# Altium schematic sheet Charger.SchDoc
size A
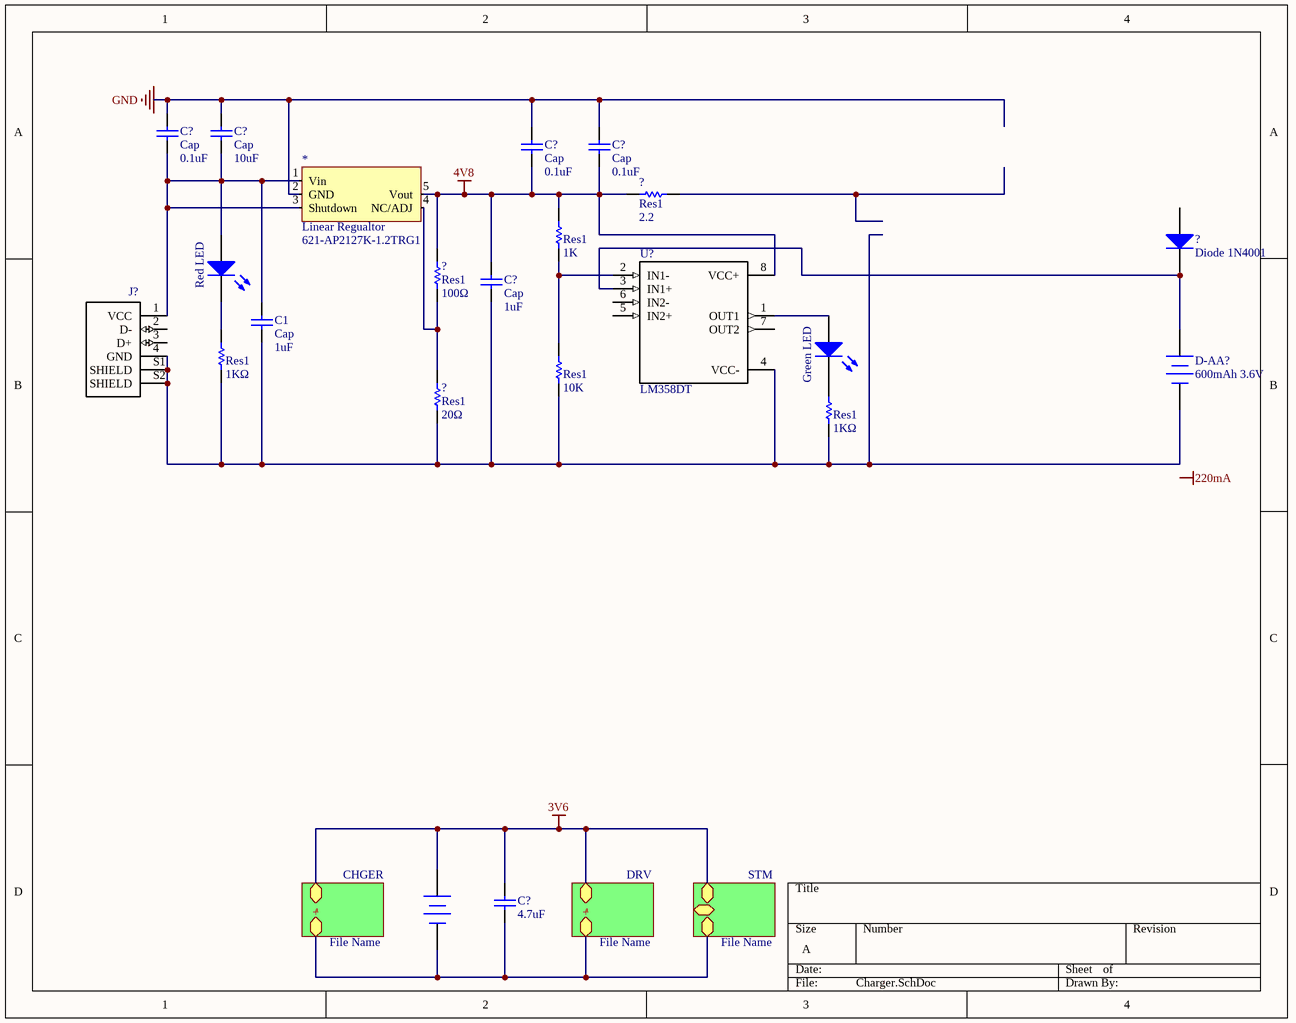
[diagram p0: Charger.SchDoc]

## Parts
(Parts that share a designator on the sheet are numbered #1, #2 ... from top to bottom, then left to right.)
*  Linear Regualtor  Supplier Part Number 1: 621-AP2127K-1.2TRG1  [SOT23-5]
?#1  Res1  value 2.2  [AXIAL-0.3]
?#2  Diode 1N4001  [DO-41]
?#3  Res1  value 1K  [AXIAL-0.3]
?#4  Res1  value 100Ω  [AXIAL-0.3]
?#5  Res1  value 1KΩ  [AXIAL-0.3]
?#6  Res1  value 10K  [AXIAL-0.3]
?#7  Res1  value 20Ω  [AXIAL-0.3]
?#8  Res1  value 1KΩ  [AXIAL-0.3]
C1  Cap  value 1uF  [RAD-0.3]
C?#1  Cap  value 0.1uF  [RAD-0.3]
C?#2  Cap  value 10uF  [RAD-0.3]
C?#3  Cap  value 0.1uF  [RAD-0.3]
C?#4  Cap  value 0.1uF  [RAD-0.3]
C?#5  Cap  value 1uF  [RAD-0.3]
C?#6  value 4.7uF  [RAD-0.3]  (hidden comment: Cap)
D-AA?  600mAh 3.6V
Green_LED  (no value)  [3.2X1.6X1.1]
J?  1-1734028-1  [*TE_1-1734028-1_1-1734028-1(Primary)]  (value not drawn)
N-?  700mAh 2.4V  [BAT-2]  (value not drawn)
Red_LED  (no value)  [LED-1]
U?  LM358DT  [*SOIC127P600X175-8N]

## Sub-sheets
CHGER = File Name: +, -
DRV = File Name: +, -
STM = File Name: +, -,  (bidir)

## Nets
3V6: C?#6.1 N-?.1(+) ; sheet STM/+, sheet DRV/+, sheet CHGER/+
4V8: *.5(Vout) ?#1.2 ?#3.2 ?#4.2 C?#3.1 C?#4.1 C?#5.2 U?.8(VCC+)
GND: *.2(GND) C?#1.2 C?#2.2 C?#3.2 C?#4.2
Net*_1: *.1(Vin) *.3(Shutdown) C1.2 C?#1.1 C?#2.1 J?.1(VCC) Red_LED.1(A)
Net*_4: *.4(NC/ADJ) ?#4.1 ?#7.2
Net?#2_2: ?#2.2(K) D-AA?.1(+) U?.3(IN1+)
Net?#3_1: ?#3.1 ?#6.2 U?.2(IN1-)
Net?#5_1: ?#5.1 ?#6.1 ?#7.1 ?#8.1 C1.1 C?#5.1 D-AA?.2(-) J?.4(GND) J?.S1(SHIELD) J?.S2(SHIELD) U?.4(VCC-)
Net?#5_2: ?#5.2 Red_LED.2(K)
Net?#8_2: ?#8.2 Green_LED.2(K)
NetC?#6_2: C?#6.2 N-?.2(-) ; sheet STM/-, sheet DRV/-, sheet CHGER/-
NetGreen_LED_1: Green_LED.1(A) U?.1(OUT1)

Not connected (* = marked no-connect by the designer): ?#1 1; ?#2 1(A); J? 2(D-) 3(D+); U? 5(IN2+) 6(IN2-) 7(OUT2)

## Notes on the sheet
- Labels drawn without touching a wire or pin: 220mA

## Library data of the parts
?#1 ?#3-?#8 = Res1: Resistor; Published: 8-Jun-2000; LatestRevisionDate: 17-Jul-2002; LatestRevisionNote: Re-released for DXP Platform.; PackageReference: AXIAL-0.3; Publisher: Altium Limited; PackageDescription: Axial Device, Thru-Hole; 2 Leads; 0.3 in Pin Spacing
?#2 = Diode 1N4001: 1 Amp General Purpose Rectifier; Published: 8-Jun-2000; LatestRevisionDate: 17-Jul-2002; LatestRevisionNote: Re-released for DXP Platform.; DatasheetVersion: 1998; PackageVersion: Aug-1999; PackageReference: DO-41; Publisher: Altium Limited; PackageDescription: Diode, Axial; Body 5.2 x 2.7 mm (LxDia. max), Lead Dia. 0.86 mm (max); Code_JEDEC: DO-204-AL; ComponentLink1Description: Manufacturer Link; ComponentLink1URL: http://www.fairchildsemi.com/; ComponentLink2Description: Datasheet; ComponentLink2URL: http://www.fairchildsemi.com/ds/1N%2F1N4001.pdf
C1 C?#1-C?#6 = Cap: Capacitor; Published: 8-Jun-2000; LatestRevisionDate: 17-Jul-2002; LatestRevisionNote: Re-released for DXP Platform.; PackageReference: RAD-0.3; Publisher: Altium Limited; PackageDescription: Radial Cap, Thru-Hole; 2 Leads; 0.3 in Pin Spacing
D-AA? N-? = Battery: Multicell Battery; Published: 24-Mar-1999; LatestRevisionDate: 17-Jul-2002; LatestRevisionNote: Re-released for DXP Platform.; PackageReference: BAT-2; Publisher: Altium Limited; PackageDescription: Battery; 2 Leads
Green_LED = LED2: Typical RED, GREEN, YELLOW, AMBER GaAs LED; Published: 8-Jun-2000; LatestRevisionDate: 17-Jul-2002; LatestRevisionNote: Re-released for DXP Platform.; PackageVersion: Feb-2002; PackageReference: 3.2X1.6X1.1; Publisher: Altium Limited; PackageDescription: SM LED; 2 Flat Leads
J? = 1-1734028-1: USB CONN,Plug R/A SMT,Post 1.1,Reel; Product_Type: Connector; Centerline_Pitch: 2 mm[.078 in]; Number_of_Positions: 4; MF: TE Connectivity; Price: None; SnapEDA_Link: https://www.snapeda.com/parts/1-1734028-1/TE%20Connectivity%20AMP%20Connectors/view-part/?ref=snap; MP: 1-1734028-1; Availability: Unavailable; Package: None; TE_purchase_URL: https://www.te.com/usa-en/product-1-1734028-1.html?te_bu=Cor&te_type=disp&te_campaign=seda_glo_cor-seda-global-disp-prtnr-fy19-seda-model-bom-cta_sma-317_1&elqCampaignId=32493; Value: *
Red_LED = LED1: Typical RED GaAs LED; Published: 8-Jun-2000; LatestRevisionDate: 08-Jul-2005; LatestRevisionNote: Mech Layer 1 removed.; PackageReference: LED-1; Publisher: Altium Limited; PackageDescription: LED; 2 Leads
U? = LM358DT: LM358 Series 30 V 1.1 MHz Low Power Dual Operational Amplifier - SOIC-8; MF: STMicroelectronics; MP: LM358DT; SnapEDA_Link: https://www.snapeda.com/parts/LM358DT/STMicroelectronics/view-part/?ref=snap; Digi-Key_Purchase_URL: https://www.digikey.com/product-detail/en/rohm-semiconductor/LM358DT/LM358DTCT-ND/1878968?utm_source=snapeda&utm_medium=aggregator&utm_campaign=symbol; Package: SOIC-8 STMicroelectronics; Digi-Key_Part_Number: LM358DTCT-ND; Value: *
* = Linear Regualtor: Supplier 1: Mouser